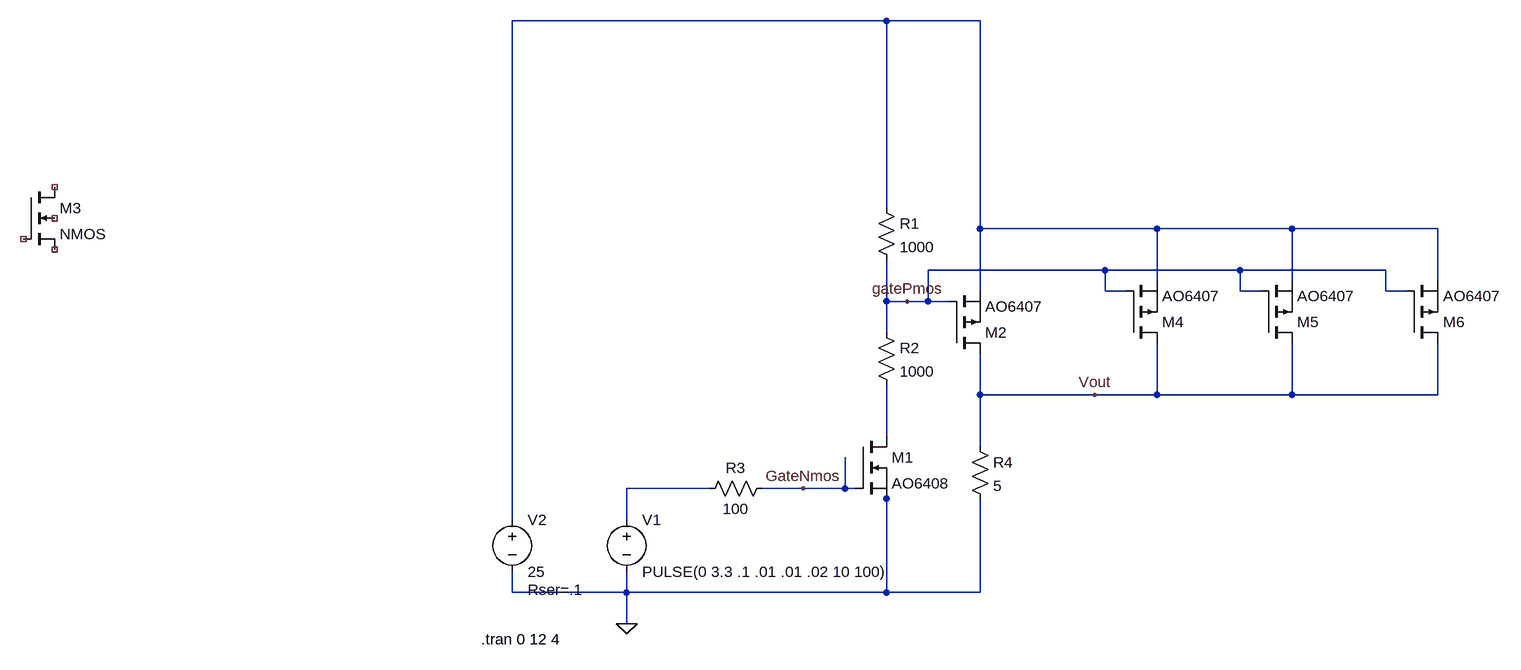
[diagram p0: schematic ModRect.asc]
ModRect.asc, the LTspice schematic file:
Version 4
SHEET 1 1144 680
WIRE 192 -640 -384 -640
WIRE 336 -640 192 -640
WIRE 192 -352 192 -640
WIRE 336 -320 336 -640
WIRE 608 -320 336 -320
WIRE 816 -320 608 -320
WIRE 1040 -320 816 -320
WIRE 528 -256 256 -256
WIRE 736 -256 528 -256
WIRE 960 -256 736 -256
WIRE 608 -240 608 -320
WIRE 816 -240 816 -320
WIRE 1040 -240 1040 -320
WIRE 336 -224 336 -320
WIRE 528 -224 528 -256
WIRE 560 -224 528 -224
WIRE 736 -224 736 -256
WIRE 768 -224 736 -224
WIRE 960 -224 960 -256
WIRE 992 -224 960 -224
WIRE 192 -208 192 -272
WIRE 224 -208 192 -208
WIRE 256 -208 256 -256
WIRE 256 -208 224 -208
WIRE 288 -208 256 -208
WIRE 192 -160 192 -208
WIRE 336 -64 336 -128
WIRE 512 -64 336 -64
WIRE 608 -64 608 -144
WIRE 608 -64 512 -64
WIRE 816 -64 816 -144
WIRE 816 -64 608 -64
WIRE 1040 -64 1040 -144
WIRE 1040 -64 816 -64
WIRE 192 0 192 -80
WIRE 336 16 336 -64
WIRE -80 80 -208 80
WIRE 64 80 0 80
WIRE 128 80 128 32
WIRE 128 80 64 80
WIRE 144 80 128 80
WIRE 192 96 192 48
WIRE -384 128 -384 -640
WIRE -208 128 -208 80
WIRE -384 240 -384 208
WIRE -208 240 -208 208
WIRE -208 240 -384 240
WIRE 192 240 192 96
WIRE 192 240 -208 240
WIRE 336 240 336 96
WIRE 336 240 192 240
WIRE -208 288 -208 240
FLAG -208 288 0
FLAG 64 80 GateNmos
FLAG 224 -208 gatePmos
FLAG 512 -64 Vout
SYMBOL voltage -208 112 R0
WINDOW 123 0 0 Left 0
WINDOW 39 0 0 Left 0
SYMATTR InstName V1
SYMATTR Value PULSE(0 3.3 .1 .01 .01 .02 10 100)
SYMBOL nmos 144 0 R0
SYMATTR InstName M1
SYMATTR Value AO6408
SYMBOL pmos 288 -128 M180
SYMATTR InstName M2
SYMATTR Value AO6407
SYMBOL res 176 -368 R0
SYMATTR InstName R1
SYMATTR Value 1000
SYMBOL res 176 -176 R0
SYMATTR InstName R2
SYMATTR Value 1000
SYMBOL voltage -384 112 R0
WINDOW 123 0 0 Left 0
WINDOW 39 24 124 Left 2
SYMATTR SpiceLine Rser=.1
SYMATTR InstName V2
SYMATTR Value 25
SYMBOL res 16 64 R90
WINDOW 0 0 56 VBottom 2
WINDOW 3 32 56 VTop 2
SYMATTR InstName R3
SYMATTR Value 100
SYMBOL res 320 0 R0
SYMATTR InstName R4
SYMATTR Value 5
SYMBOL nmos4 -1136 -384 R0
SYMATTR InstName M3
SYMBOL pmos 560 -144 M180
SYMATTR InstName M4
SYMATTR Value AO6407
SYMBOL pmos 768 -144 M180
SYMATTR InstName M5
SYMATTR Value AO6407
SYMBOL pmos 992 -144 M180
SYMATTR InstName M6
SYMATTR Value AO6407
TEXT -432 312 Left 2 !.tran 0 12 4

The netlist it stands for:
* ModRect.asc
V1 N003 0 PULSE(0 3.3 .1 .01 .01 .02 10 100)
M1 N002 GateNmos 0 0 AO6408
M2 Vout gatePmos N001 N001 AO6407
R1 N001 gatePmos 1000
R2 gatePmos N002 1000
V2 N001 0 25 Rser=.1
R3 GateNmos N003 100
R4 Vout 0 5
M3 NC_01 NC_02 NC_03 NC_04 NMOS
M4 Vout gatePmos N001 N001 AO6407
M5 Vout gatePmos N001 N001 AO6407
M6 Vout gatePmos N001 N001 AO6407
.model NMOS NMOS
.model PMOS PMOS
.lib standard.mos
.tran 0 12 4
.backanno
.end